# EAGLE design arduinoVisor3pro (EAGLE 9.5.2)

## Sheet 1 of 2
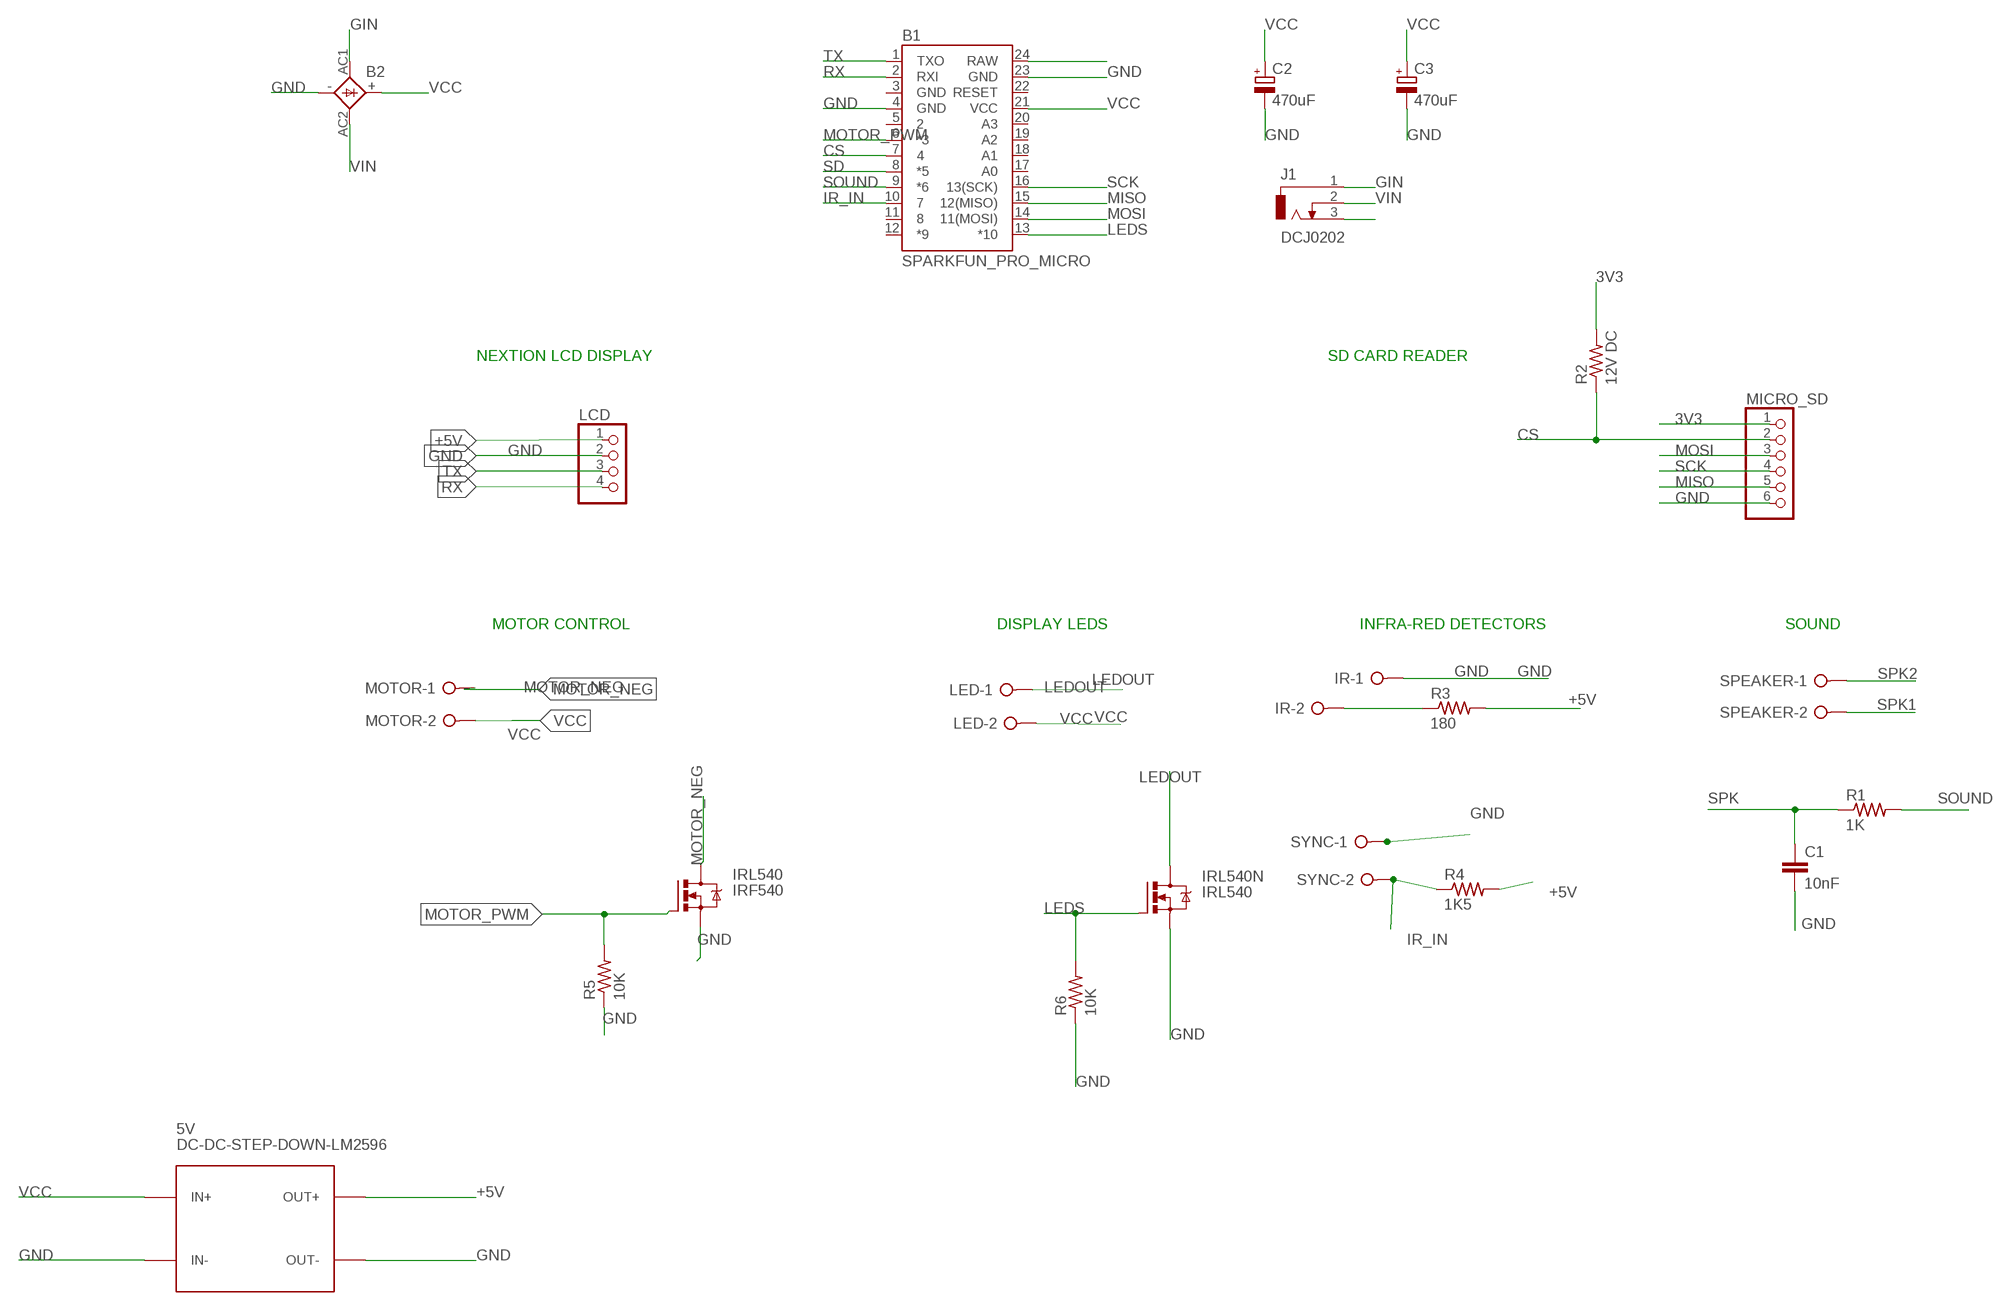
[diagram p0: schematic, sheet 1]

### Parts
5V  DC-DC-STEP-DOWN-LM2596  [DC-DC-STEP-DOWN-LM2596]
B1  SPARKFUN_PRO_MICRO  [SPARKFUN_PRO_MICRO]
B2  1KAB  [1KAB]
C1  10nF  C2.5/2  [C2.5-2]
C2  470uF  CPOL-EUE5-6  [E5-6]
C3  470uF  CPOL-EUE5-6  [E5-6]
IR  W237-02P  [W237-132]
IRL540  IRF540  [TO220BV]
IRL540N  IRL540  IRF540  [TO220BV]
J1  DCJ0202  [DCJ0202]
LCD  PINHD-1X4  [1X04]
LED  W237-02P  [W237-132]
MICRO_SD  PINHD-1X6  [1X06]
MOTOR  W237-02P  [W237-132]
R1  1K  R-US_0207/10  [0207/10]
R2  12V DC  R-US_0207/10  [0207/10]
R3  180  R-US_0207/10  [0207/10]
R4  1K5  R-US_0207/10  [0207/10]
R5  10K  R-US_0207/10  [0207/10]
R6  10K  R-US_0207/10  [0207/10]
SPEAKER  W237-02P  [W237-132]
SYNC  W237-02P  [W237-132]

### Nets
3V3: MICRO_SD.1 R2.2
+5V: 5V.OUT+ B1.24(RAW) LCD.1 R3.2 R4.2 ; also sheet 2
CS: B1.7 MICRO_SD.2 R2.1
GIN: B2.AC1 J1.1
GND: 5V.IN- 5V.OUT- B1.4(GND) B1.23(GND) B2.- C1.2 C2.- C3.- IR.1 IRL540.S IRL540N.S LCD.2 MICRO_SD.6 R5.1 R6.1 SYNC.1 ; also sheet 2
IR_IN: B1.10 R4.1 SYNC.2
IR_OUT: IR.2 R3.1
LEDOUT: IRL540N.D LED.1
LEDS: B1.13(*10) IRL540N.G R6.2
MISO: B1.15(12(MISO)) MICRO_SD.5
MOSI: B1.14(11(MOSI)) MICRO_SD.3
MOTOR_NEG: IRL540.D MOTOR.1
MOTOR_PWM: B1.6(*3) IRL540.G R5.2
N$3: J1.3
RX: B1.2(RXI) LCD.4
SCK: B1.16(13(SCK)) MICRO_SD.4
SD: B1.8(*5) ; also sheet 2
SOUND: B1.9(*6) R1.2
SPK: C1.1 R1.1 ; also sheet 2
SPK1: SPEAKER.2 ; also sheet 2
SPK2: SPEAKER.1 ; also sheet 2
TX: B1.1(TXO) LCD.3
VCC: 5V.IN+ B1.21(VCC) B2.+ C2.+ C3.+ LED.2 MOTOR.2
VIN: B2.AC2 J1.2
Unconnected: B1.5 B1.11 B1.12(*9) B1.17(A0) B1.18(A1) B1.19(A2) B1.20(A3) B1.22(RESET)

### Notes on the sheet
- NEXTION LCD DISPLAY | SD CARD READER
- MOTOR CONTROL | DISPLAY LEDS | INFRA-RED DETECTORS | SOUND

## Sheet 2 of 2
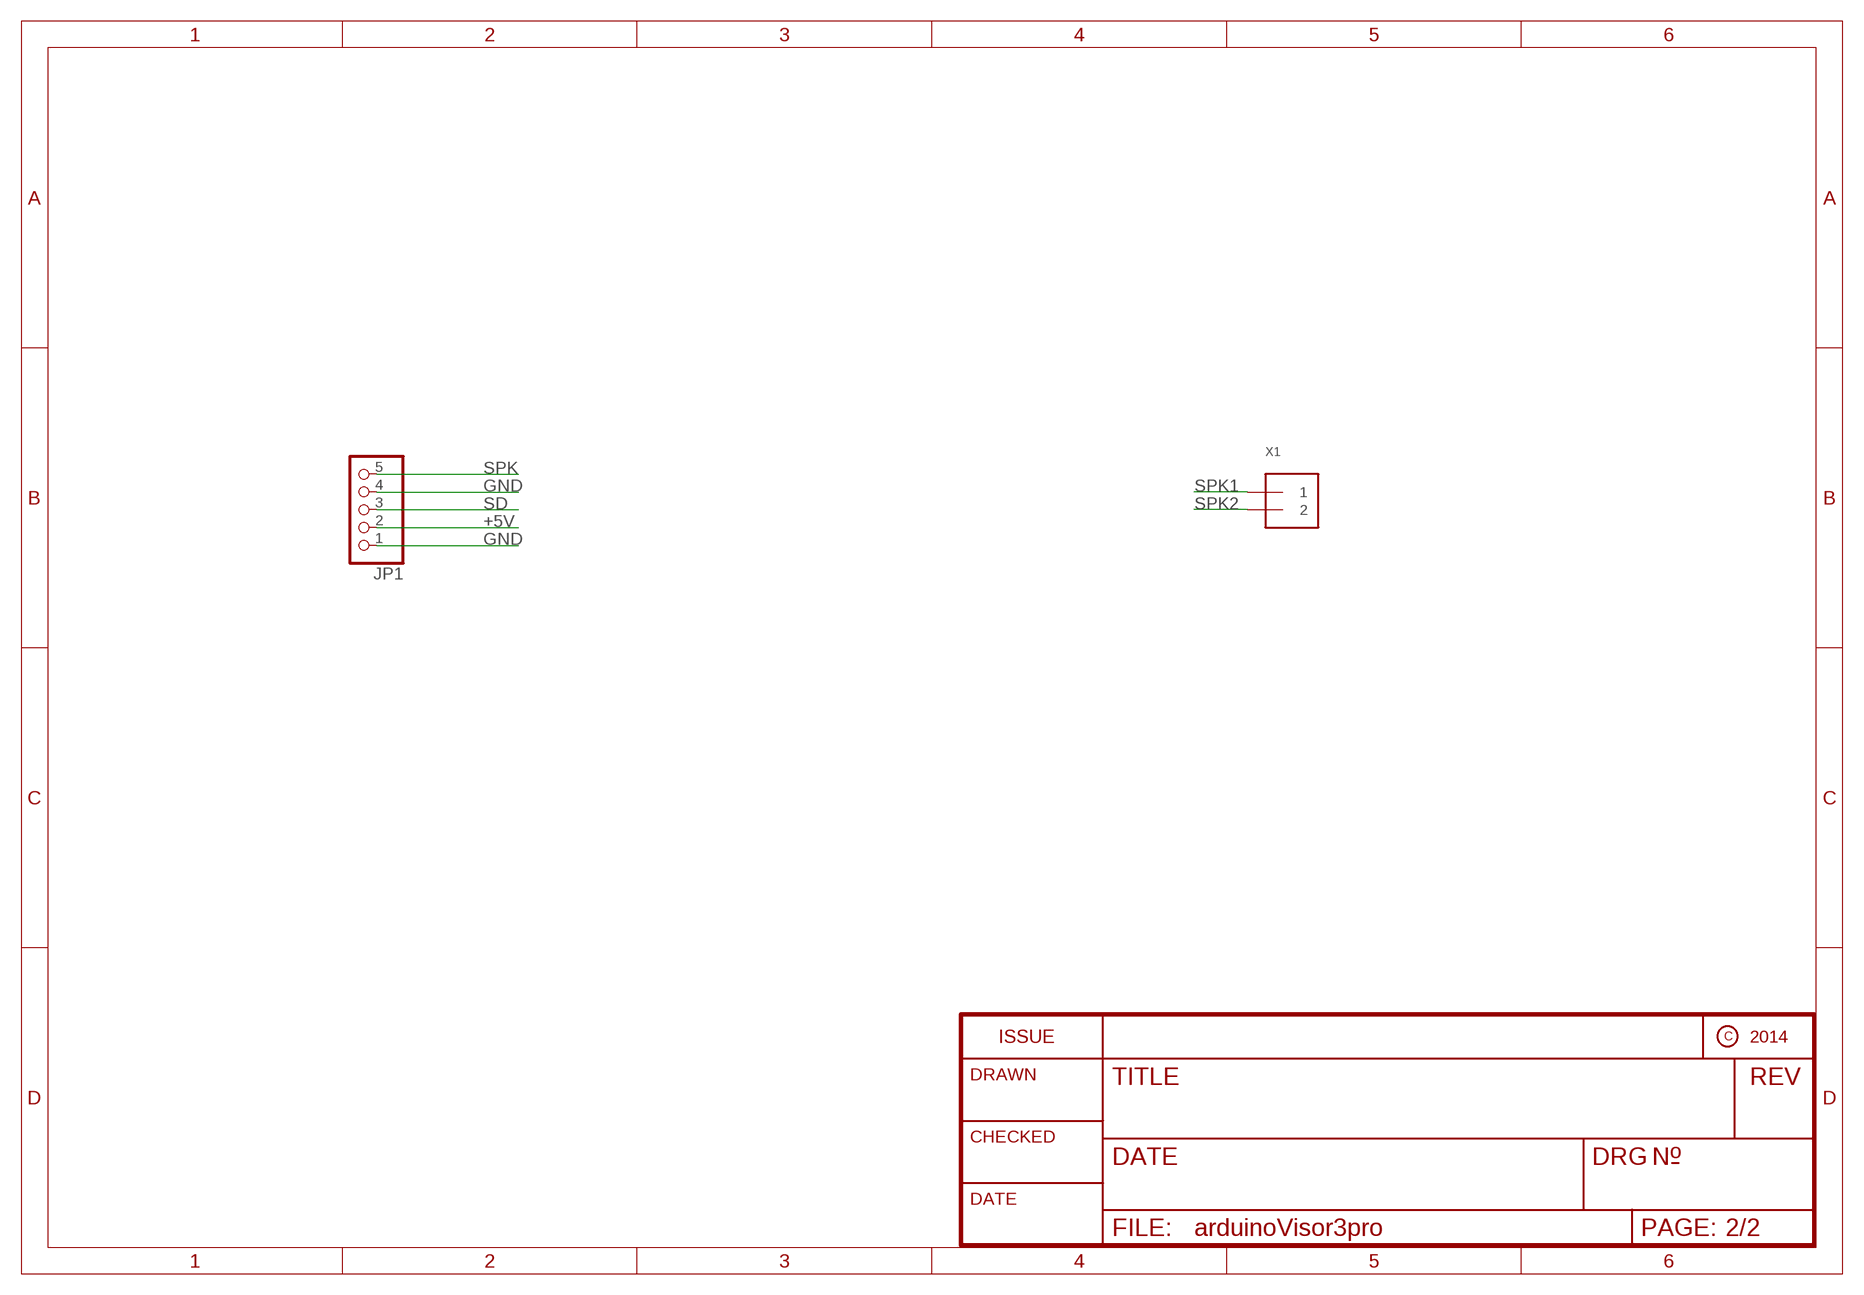
[diagram p1: schematic, sheet 2]

### Parts
JP1  HEADER-1X570MIL  [1X05_ROUND_70]
X1  TERMBLOCK_1X2  [TERMBLOCK_1X2-3.5MM]

### Nets
+5V: JP1.2 ; also sheet 1
GND: JP1.1 JP1.4 ; also sheet 1
SD: JP1.3 ; also sheet 1
SPK: JP1.5 ; also sheet 1
SPK1: X1.1 ; also sheet 1
SPK2: X1.2 ; also sheet 1

## Power pins joined to a net without a drawn wire
GND: B1.3(GND)

## Library data of the parts
5V = diy-modules boo:DC-DC-STEP-DOWN-LM2596: DC/DC Step-Down Regulator based on LM2596-ADJ chip LM2596 datasheet available here: http://www.ti.com/lit/ds/symlink/lm2596.pdf Click here to find device on ebay.com <http://www.ebay.com/sch/lm2596+power+regulator>
B1 = SparkFun-Boards:SPARKFUN_PRO_MICRO: SparkFun Pro Micro Atmega32U4 compatible footprint. SparkFun Products: 3.3V/8MHz <https://www.sparkfun.com/products/12587> 5V/16MHz <https://www.sparkfun.com/products/12640>
B2 = rectifier:1KAB: RECTIFIER grid 5,08 x 5,08 mm
C1 = capacitor-wima:C: CAPACITOR naming: grid - package width
C2 C3 = rcl:CPOL-EU: POLARIZED CAPACITOR, European symbol; SPICEPREFIX: C
IR LED MOTOR SPEAKER SYNC = con-wago-508:W237-02P: WAGO SREW CLAMP; OC_FARNELL: unknown; OC_NEWARK: unknown
IRL540 IRL540N = transistor-power:IRF540: HEXFET Power MOSFET
J1 = con-jack:DCJ0202: DC POWER JACK Source: DCJ0202.pdf; OC_FARNELL: unknown; OC_NEWARK: unknown
JP1 = microbuilder:HEADER-1X5: PIN HEADER
LCD = pinhead:PINHD-1X4: PIN HEADER
MICRO_SD = pinhead:PINHD-1X6: PIN HEADER
R1-R6 = rcl:R-US_: RESISTOR, American symbol
X1 = microbuilder:TERMBLOCK_1X2: 3.5mm Terminal block http://www.ladyada.net/library/pcb/eaglelibrary.html

## Board
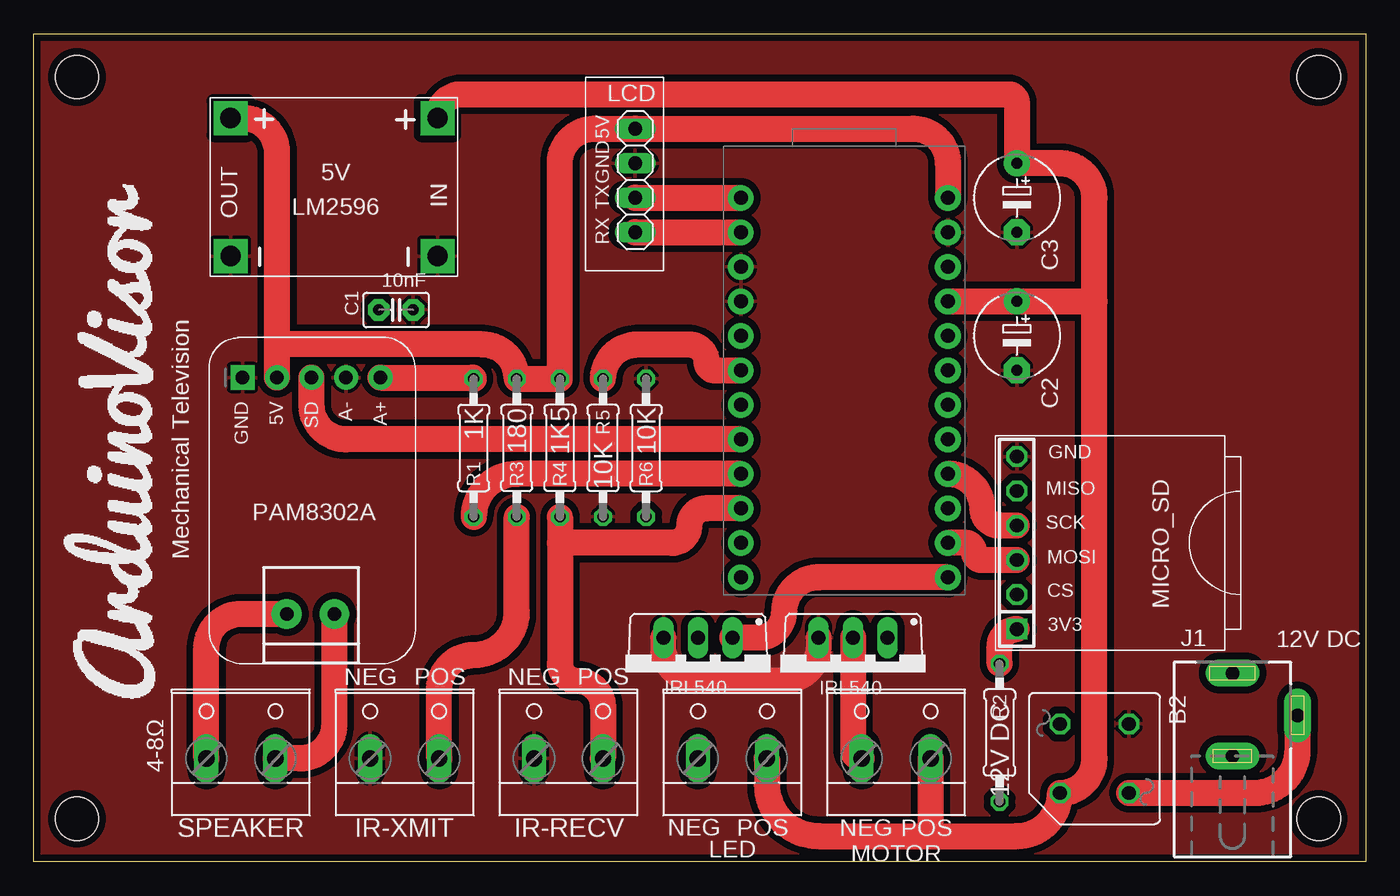
[diagram p2: board, top side]
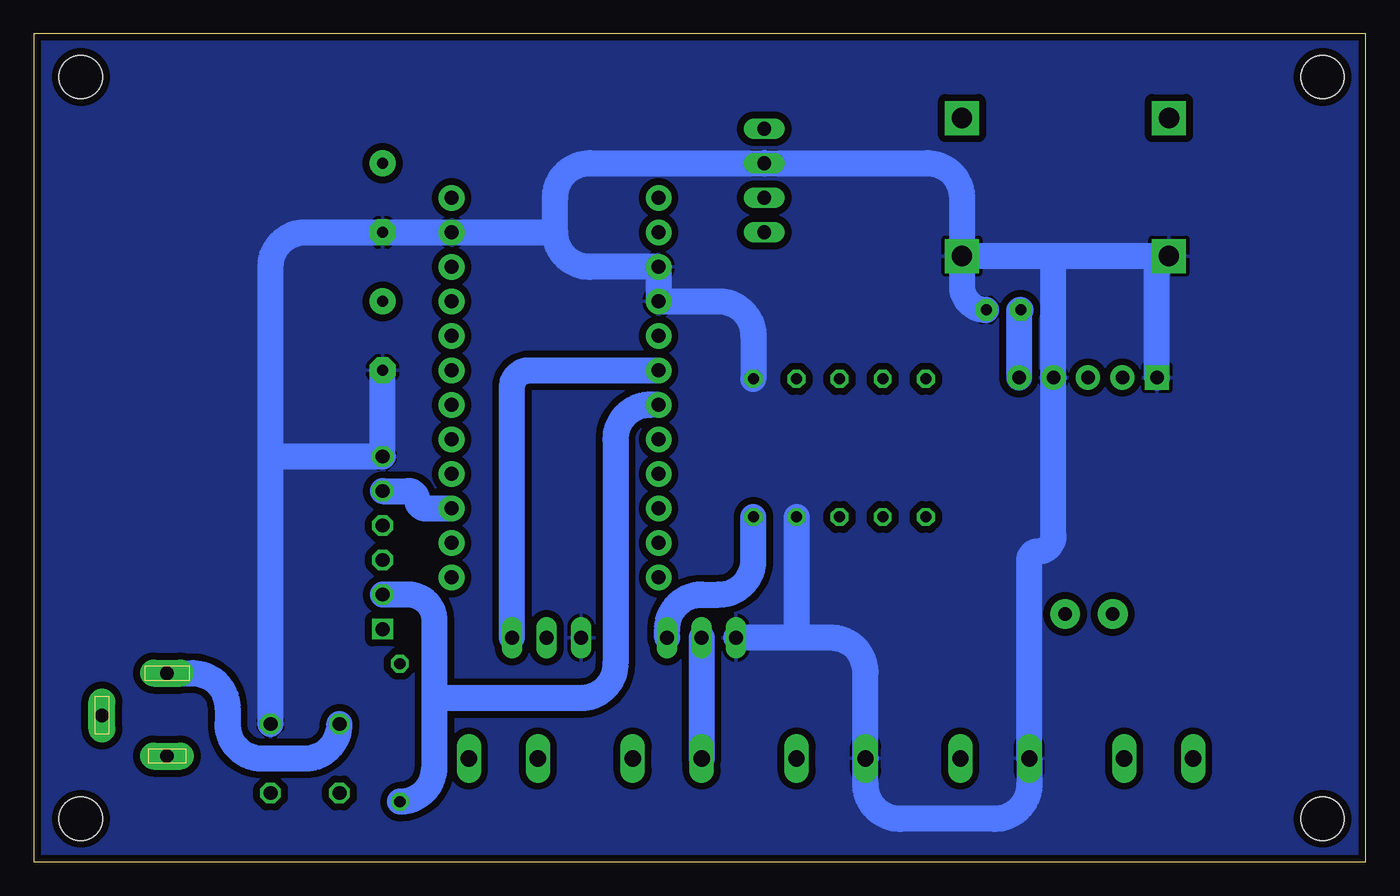
[diagram p3: board, bottom side, seen from below]

Size 98.07 x 60.96 mm. Coordinates in mm from the lower left corner, seen from the top.
Outline: 0,60.96 98.07,60.96 98.07,0 0,0 0,60.96
Copper layers (1*16): Top 0.035mm / dielectric 1.5mm / Bottom 0.035mm
Design rules "SeeedStudio_2layer_DRU_no_angle_20140221": minimum track width 6mil, minimum drill 12mil, track to track 6mil, track to pad 6mil, pad to pad 6mil, via to via 6mil, smd to smd 0mil, copper to edge 10mil, drill to drill 10mil, minimum pad ring 10mil, minimum via ring 6mil, stop-mask expansion 2mil, vias tented up to drill 100mil, thermal gap 10mil
Holes 3.2 mm at 3.17,57.78 94.61,57.78 3.17,3.17 94.61,3.17

### Footprints (pad centres in the part's own frame; a part is rotated, then mirrored left to right if it is on the bottom)
DC-DC-STEP-DOWN-LM2596 = drill 1.5 pad 2.5 square: IN+ 1.388,0.485; IN- 1.388,10.641; OUT+ 16.632,0.48; OUT- 16.631,10.641
SPARKFUN_PRO_MICRO = drill 1.016 pad 1.88: 1 -7.62,12.7; 2 -7.62,10.16; 3 -7.62,7.62; 4 -7.62,5.08; 5 -7.62,2.54; 6 -7.62,0; 7 -7.62,-2.54; 8 -7.62,-5.08; 9 -7.62,-7.62; 10 -7.62,-10.16; 11 -7.62,-12.7; 12 -7.62,-15.24; 13 7.62,-15.24; 14 7.62,-12.7; 15 7.62,-10.16; 16 7.62,-7.62; 17 7.62,-5.08; 18 7.62,-2.54; 19 7.62,0; 20 7.62,2.54; 21 7.62,5.08; 22 7.62,7.62; 23 7.62,10.16; 24 7.62,12.7
1KAB = drill 1.016 octagon: + 2.54,-2.54; - -2.54,2.54; AC1 -2.54,-2.54; AC2 2.54,2.54
C2.5-2 = drill 0.813 pad 1.6 octagon: 1 -1.27,0; 2 1.27,0
E5-6 = drill 0.813 pad 1.905: + -2.54,0 | drill 0.813 pad 1.905 octagon: - 2.54,0
W237-132 = drill 1.194 long: 1 -2.54,-0.635; 2 2.54,-0.635
TO220BV = drill 1.016 long: D 0,-2.54; G -2.54,-2.54; S 2.54,-2.54
DCJ0202 = drill 1 pad 2 long: 1 0,3.1; 2 4.8,0; 3 0,-3
1X05_ROUND_70 = drill 1 pad 1.778 square: 1 -5.08,0 | drill 1 pad 1.778: 2 -2.54,0; 3 0,0; 4 2.54,0; 5 5.08,0
1X04 = drill 1.016 long: 1 -3.81,0; 2 -1.27,0; 3 1.27,0; 4 3.81,0
1X06 = drill 1.016 square: 1 -6.35,0 | drill 1.016 octagon: 2 -3.81,0; 3 -1.27,0; 4 1.27,0; 5 3.81,0; 6 6.35,0
0207/10 = drill 0.813 octagon: 1 -5.08,0; 2 5.08,0
TERMBLOCK_1X2-3.5MM = drill 1 pad 2.184: 1 1.8,0; 2 -1.7,0

### Placement (x,y rotation side)
5V  31.11,55.24 180 top
B1  59.69,36.2 0 top
B2  78.11,7.62 270 top
C1  26.67,40.64 0 top
C2  72.39,38.73 270 top
C3  72.39,48.9 270 top
IR  27.3,8.26 0 top
IRL540  60.33,13.97 180 top
IRL540N  48.9,13.97 180 top
J1  88.27,10.79 0 top
JP1  20.44,35.67 0 top
LCD  44.28,50.18 270 top
LED  51.44,8.26 0 top
MICRO_SD  72.39,23.5 90 top
MOTOR  63.5,8.26 0 top
R1  32.38,30.48 270 top
R2  71.12,9.53 90 top
R3  35.56,30.48 90 top
R4  38.73,30.48 90 top
R5  41.91,30.48 90 top
R6  45.09,30.48 270 top
SPEAKER  15.24,8.26 0 top
SYNC  39.37,8.26 0 top
X1  20.32,18.27 0 top

### Tracks (layer width: path | path; a pad name or v marks a point on that pad's centre or on a via)
3V3
  Top 1.905: R2.2 71.12,15.88 arc-90 MICRO_SD.1
+5V
  Top 1.905: B1.24 67.31,51.45 arc90 64.77,53.99 LCD.1 41.27,53.99 arc90 38.73,51.45 R4.2 R3.2 arc90 33.02,38.1 17.9,38.1 | JP1.2 17.9,38.1 | 17.9,38.1 17.9,52.23 arc90 15.36,54.77 5V.OUT+
CS
  Bottom 1.905: B1.7 52.7,33.66 arc-90 55.24,31.11 55.24,14.61 arc90 57.78,12.06 68.58,12.06 | R2.1 arc-90 68.58,6.99 68.58,12.06 | 68.58,12.06 68.58,17.78 arc-90 70.48,19.68 MICRO_SD.2
GIN
  Bottom 1.905: J1.1 86.36,13.89 arc90 83.82,11.36 83.82,10.16 arc-90 81.28,7.62 78.11,7.62 arc-90 B2.AC1
GND
  Top 1.905: IRL540.S 57.78,15.88 arc-90 55.24,13.34 48.9,13.34 arc-90 46.35,15.88 IRL540N.S
  Bottom 1.905: 5V.IN- 29.73,48.91 arc-90 32.27,51.45 LCD.2 57.15,51.45 arc-90 59.69,48.91 59.69,46.35 | 5V.OUT- 15.24,44.6 | 15.24,44.6 22.86,44.6 | 22.86,44.6 5V.IN- | 5V.IN- arc-90 5V.IN- | 5V.IN- 29.73,42.43 arc-90 C1.2 | 22.86,44.6 arc-90 22.98,44.48 JP1.4 22.98,24.01 arc90 24.13,22.86 arc-90 24.77,22.23 IR.1 24.77,5.71 arc90 27.3,3.17 34.29,3.17 arc90 36.83,5.71 SYNC.1 36.83,13.97 arc-90 39.37,16.51 41.91,16.51 | JP1.1 15.36,44.48 arc90 15.24,44.6 | 41.91,16.51 IRL540N.S | R5.1 41.91,16.51 | C2.- MICRO_SD.6 80.64,29.84 | 59.69,46.35 arc-90 57.15,43.81 B1.3 B1.4 47.62,41.27 arc90 45.09,38.73 R6.1 | 59.69,46.35 B1.23 C3.- 78.11,46.35 arc-90 80.64,43.81 80.64,29.84 | B2.- 80.64,29.84
  pour Bottom (isolate 0.508): 0,60.96 0,0 98.42,0 98.42,60.96
  pour Top (isolate 0.508): 0,60.96 0,0 97.79,0 97.79,60.96
IR_IN
  Top 1.905: R4.1 38.73,23.5 | 38.73,23.5 38.73,14.61 arc90 40.01,13.34 arc-90 41.91,11.43 SYNC.2 | B1.10 49.53,26.04 arc90 48.26,24.77 arc-90 46.99,23.5 38.73,23.5
IR_OUT
  Top 1.905: IR.2 29.84,12.7 arc-90 32.38,15.24 arc90 35.56,18.41 R3.1
LEDOUT
  Bottom 1.905: IRL540N.D LED.1
LEDS
  Top 1.905: B1.13 57.78,20.95 arc90 55.24,18.41 arc-90 53.34,16.51 IRL540N.G
  Bottom 1.905: IRL540N.G 51.44,17.14 arc90 48.9,19.68 47.62,19.68 arc-90 45.09,22.23 R6.2
MISO
  Bottom 1.905: MICRO_SD.5 70.48,27.3 arc90 69.85,26.67 arc-90 69.22,26.04 B1.15
MOSI
  Top 1.905: MICRO_SD.3 69.85,22.23 arc-90 69.22,22.86 arc90 68.58,23.5 B1.14
MOTOR_NEG
  Top 1.905: IRL540.D 60.33,8.26 arc90 MOTOR.1
MOTOR_PWM
  Top 1.905: R5.2 arc-90 44.45,38.1 48.26,38.1 arc-90 49.53,36.83 arc90 50.16,36.2 B1.6
  Bottom 1.905: IRL540.G 62.87,34.92 arc90 61.59,36.2 B1.6
RX
  Top 1.905: LCD.4 arc90 44.3,46.35 B1.2
SCK
  Top 1.905: MICRO_SD.4 71.12,24.77 arc-90 69.85,26.04 arc90 B1.16
SD
  Top 1.905: B1.8 22.98,31.11 arc-90 20.44,33.66 JP1.3
SOUND
  Top 1.905: B1.9 35.56,28.57 arc90 R1.2
SPK
  Top 1.905: JP1.5 32.28,35.67 arc-90 R1.1
  Bottom 1.905: C1.1 arc-90 25.52,40.52 JP1.5
SPK1
  Top 1.905: X1.1 22.12,10.16 arc-90 19.58,7.62 SPEAKER.2
SPK2
  Top 1.905: SPEAKER.1 12.7,15.73 arc-90 15.24,18.27 X1.2
TX
  Top 1.905: LCD.3 arc90 44.3,48.9 B1.1
VCC
  Top 1.905: LED.2 53.98,5.71 arc90 57.78,1.91 66.04,1.91 | 66.04,1.91 72.39,1.91 arc90 B2.+ arc90 78.11,7.62 78.11,41.27 | MOTOR.2 66.04,1.91 | B1.21 C2.+ 78.11,41.27 | 5V.IN+ arc-90 31.48,56.52 71.75,56.52 arc-90 72.39,55.88 C3.+ 75.56,51.44 arc-90 78.11,48.9 78.11,41.27
VIN
  Top 1.905: B2.AC2 89.89,5.08 arc90 93.06,8.26 J1.2

### Text on the board
tPlace: 5V | GND | TX | RX | GND | 5V | SD | A- | A+ | Mechanical Television | GND | MISO | PAM8302A | SCK | MOSI | CS | 3V3 | 12V DC | NEG | POS | NEG | POS | 4-8Ω | SPEAKER | IR-XMIT | IR-RECV | NEG | POS | NEG | POS | LED | MOTOR
tNames: IRL540 | IRL540